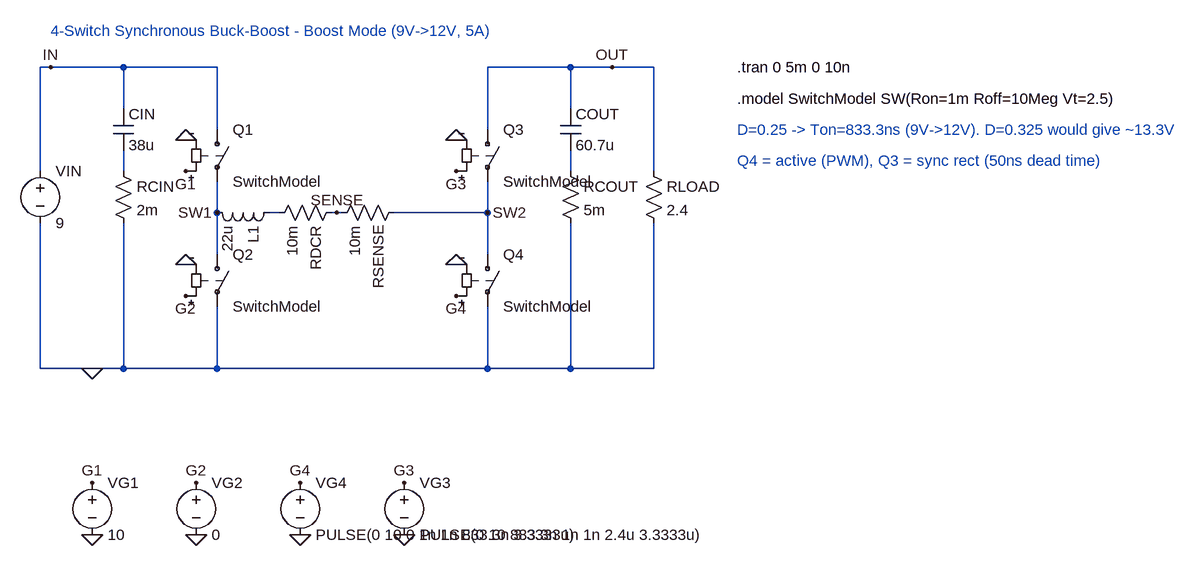
[diagram p0: schematic BuckBoost_4Switch.asc]
BuckBoost_4Switch.asc, the LTspice schematic file:
Version 4
SHEET 1 2000 1200
WIRE 80 96 352 96
WIRE 768 96 1024 96
WIRE 80 560 1024 560
WIRE 80 96 80 256
WIRE 80 336 80 560
WIRE 208 96 208 160
WIRE 208 224 208 256
WIRE 208 336 208 560
WIRE 352 96 352 192
WIRE 352 272 352 320
WIRE 352 320 352 384
WIRE 352 464 352 560
WIRE 432 320 448 320
WIRE 528 320 544 320
WIRE 624 320 768 320
WIRE 768 96 768 192
WIRE 768 272 768 320
WIRE 768 320 768 384
WIRE 768 464 768 560
WIRE 896 96 896 160
WIRE 896 224 896 256
WIRE 896 336 896 560
WIRE 1024 96 1024 256
WIRE 1024 336 1024 560
FLAG 96 96 IN
FLAG 960 96 OUT
FLAG 352 320 SW1
FLAG 768 320 SW2
FLAG 536 320 SENSE
FLAG 160 560 0
FLAG 304 256 G1
FLAG 304 208 0
FLAG 304 448 G2
FLAG 304 400 0
FLAG 720 256 G3
FLAG 720 208 0
FLAG 720 448 G4
FLAG 720 400 0
FLAG 160 736 G1
FLAG 160 816 0
FLAG 320 736 G2
FLAG 320 816 0
FLAG 480 736 G4
FLAG 480 816 0
FLAG 640 736 G3
FLAG 640 816 0
SYMBOL voltage 80 240 R0
SYMATTR InstName VIN
SYMATTR Value 9
SYMBOL cap 192 160 R0
SYMATTR InstName CIN
SYMATTR Value 38u
SYMBOL res 192 240 R0
SYMATTR InstName RCIN
SYMATTR Value 2m
SYMBOL sw 352 176 R0
SYMATTR InstName Q1
SYMATTR Value SwitchModel
SYMBOL sw 352 368 R0
SYMATTR InstName Q2
SYMATTR Value SwitchModel
SYMBOL ind 448 304 R90
SYMATTR InstName L1
SYMATTR Value 22u
SYMBOL res 544 304 R90
SYMATTR InstName RDCR
SYMATTR Value 10m
SYMBOL res 640 304 R90
SYMATTR InstName RSENSE
SYMATTR Value 10m
SYMBOL sw 768 176 R0
SYMATTR InstName Q3
SYMATTR Value SwitchModel
SYMBOL sw 768 368 R0
SYMATTR InstName Q4
SYMATTR Value SwitchModel
SYMBOL cap 880 160 R0
SYMATTR InstName COUT
SYMATTR Value 60.7u
SYMBOL res 880 240 R0
SYMATTR InstName RCOUT
SYMATTR Value 5m
SYMBOL res 1008 240 R0
SYMATTR InstName RLOAD
SYMATTR Value 2.4
SYMBOL voltage 160 720 R0
SYMATTR InstName VG1
SYMATTR Value 10
SYMBOL voltage 320 720 R0
SYMATTR InstName VG2
SYMATTR Value 0
SYMBOL voltage 480 720 R0
SYMATTR InstName VG4
SYMATTR Value PULSE(0 10 0 1n 1n 833.3n 3.3333u)
SYMBOL voltage 640 720 R0
SYMATTR InstName VG3
SYMATTR Value PULSE(0 10 883.3n 1n 1n 2.4u 3.3333u)
TEXT 96 40 Left 2 ;4-Switch Synchronous Buck-Boost - Boost Mode (9V->12V, 5A)
TEXT 1152 96 Left 2 !.tran 0 5m 0 10n
TEXT 1152 144 Left 2 !.model SwitchModel SW(Ron=1m Roff=10Meg Vt=2.5)
TEXT 1152 192 Left 2 ;D=0.25 -> Ton=833.3ns (9V->12V). D=0.325 would give ~13.3V
TEXT 1152 240 Left 2 ;Q4 = active (PWM), Q3 = sync rect (50ns dead time)

The netlist it stands for:
* BuckBoost_4Switch.asc
VIN IN 0 9
CIN IN N001 38u
RCIN N001 0 2m
S§Q1 IN SW1 G1 0 SwitchModel
S§Q2 SW1 0 G2 0 SwitchModel
L1 N002 SW1 22u
RDCR SENSE N002 10m
RSENSE SW2 SENSE 10m
S§Q3 OUT SW2 G3 0 SwitchModel
S§Q4 SW2 0 G4 0 SwitchModel
COUT OUT N003 60.7u
RCOUT N003 0 5m
RLOAD OUT 0 2.4
VG1 G1 0 10
VG2 G2 0 0
VG4 G4 0 PULSE(0 10 0 1n 1n 833.3n 3.3333u)
VG3 G3 0 PULSE(0 10 883.3n 1n 1n 2.4u 3.3333u)
* 4-Switch Synchronous Buck-Boost - Boost Mode (9V->12V, 5A)
.tran 0 5m 0 10n
.model SwitchModel SW(Ron=1m Roff=10Meg Vt=2.5)
* D=0.25 -> Ton=833.3ns (9V->12V). D=0.325 would give ~13.3V
* Q4 = active (PWM), Q3 = sync rect (50ns dead time)
.backanno
.end